# Altium schematic sheet LCD.SchDoc
size A; SheetNumber: 4; SheetTotal: 11
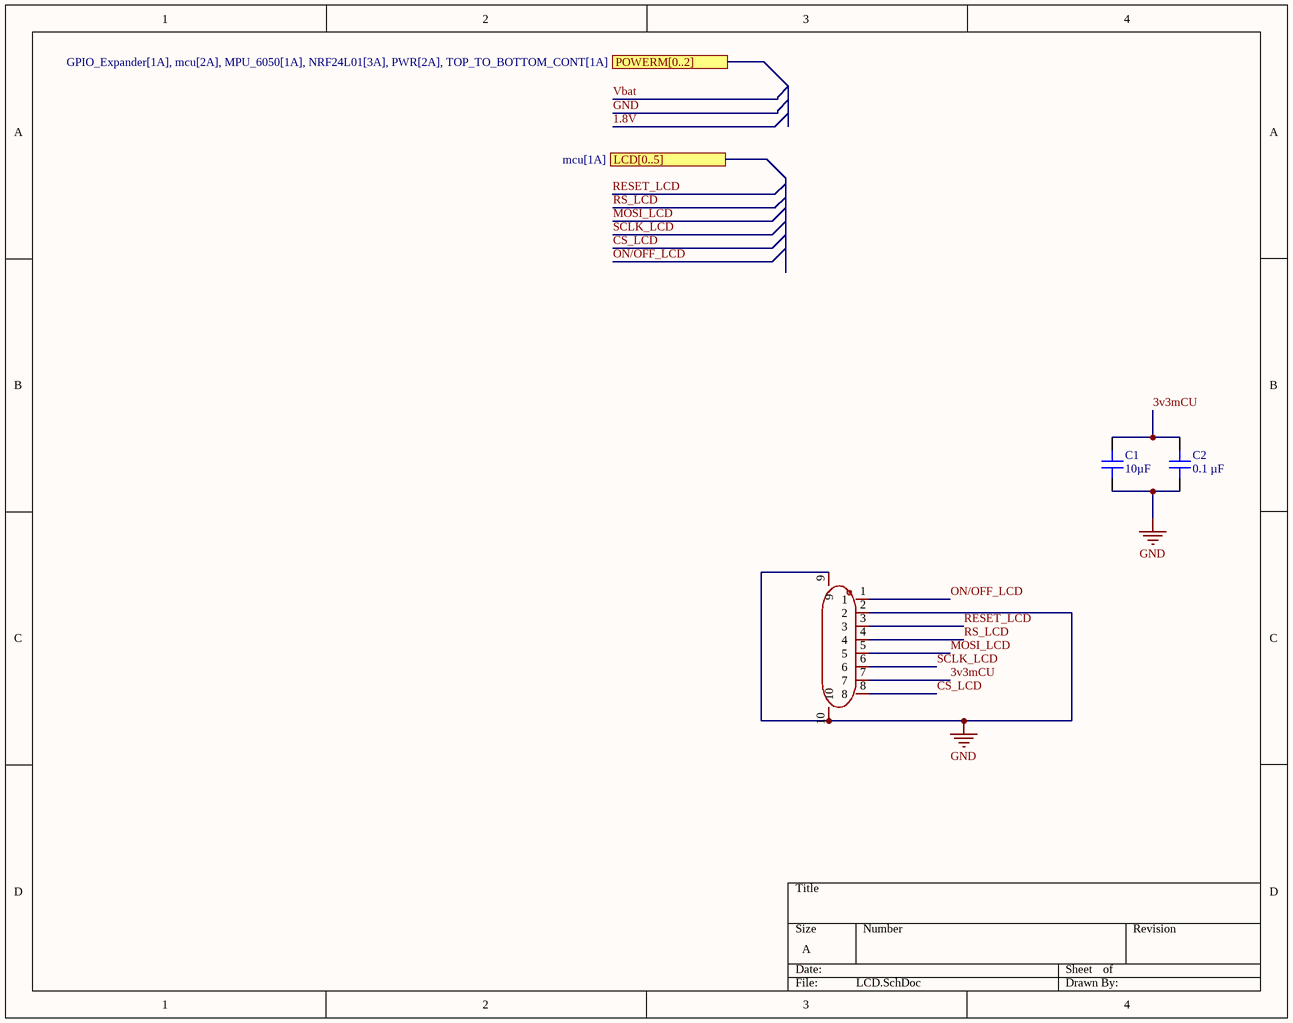
[diagram p0: LCD.SchDoc]

## Parts
C1  Capacitance: 10µF  [CAP 0402_1005]
C2  Capacitance: 0.1 µF  [CAP 0402_1005]
FPC1  AFC04-S08ECA-00  [FPC-SMD_AFC04-S08ECA-00]  (value not drawn)

## Ports
LCD[0..5] (see mcu[1A]), POWERM[0..2] (see GPIO_Expander[1A], mcu[2A], MPU_6050[1A], NRF24L01[3A], PWR[2A], TOP_TO_BOTTOM_CONT[1A])

## Nets
GND: C1.1 C2.1 FPC1.2 FPC1.9 FPC1.10
3v3mCU: C1.2 C2.2 FPC1.7
CS_LCD: FPC1.8
MOSI_LCD: FPC1.5
ON/OFF_LCD: FPC1.1
RESET_LCD: FPC1.3
RS_LCD: FPC1.4
SCLK_LCD: FPC1.6

## Library data of the parts
C1 = 0402ZD106MAT2A: CAP CER 10UF 10V X5R 0402; MFR.Part #: CL05A106MP8NUB8; Manufacturer: Samsung Electro-Mechanics; JLCPCB Part #: C307415
C2 = MD0402BB104K100NGHT-EM: CAP CER 0.1UF 10V X7R 0402; MFR.Part #: GRM155R71A104KA01D; Manufacturer: Murata Electronics; JLCPCB Part #: C71687
FPC1 = AFC04-S08ECA-00: Manufacturer: JUSHUO; JLCPCB Part #: C883637; MFR.Part #: AFC04-S08ECA-00